# Altium schematic sheet Adder.SchDoc
size A4; SheetNumber: 1; SheetTotal: 1
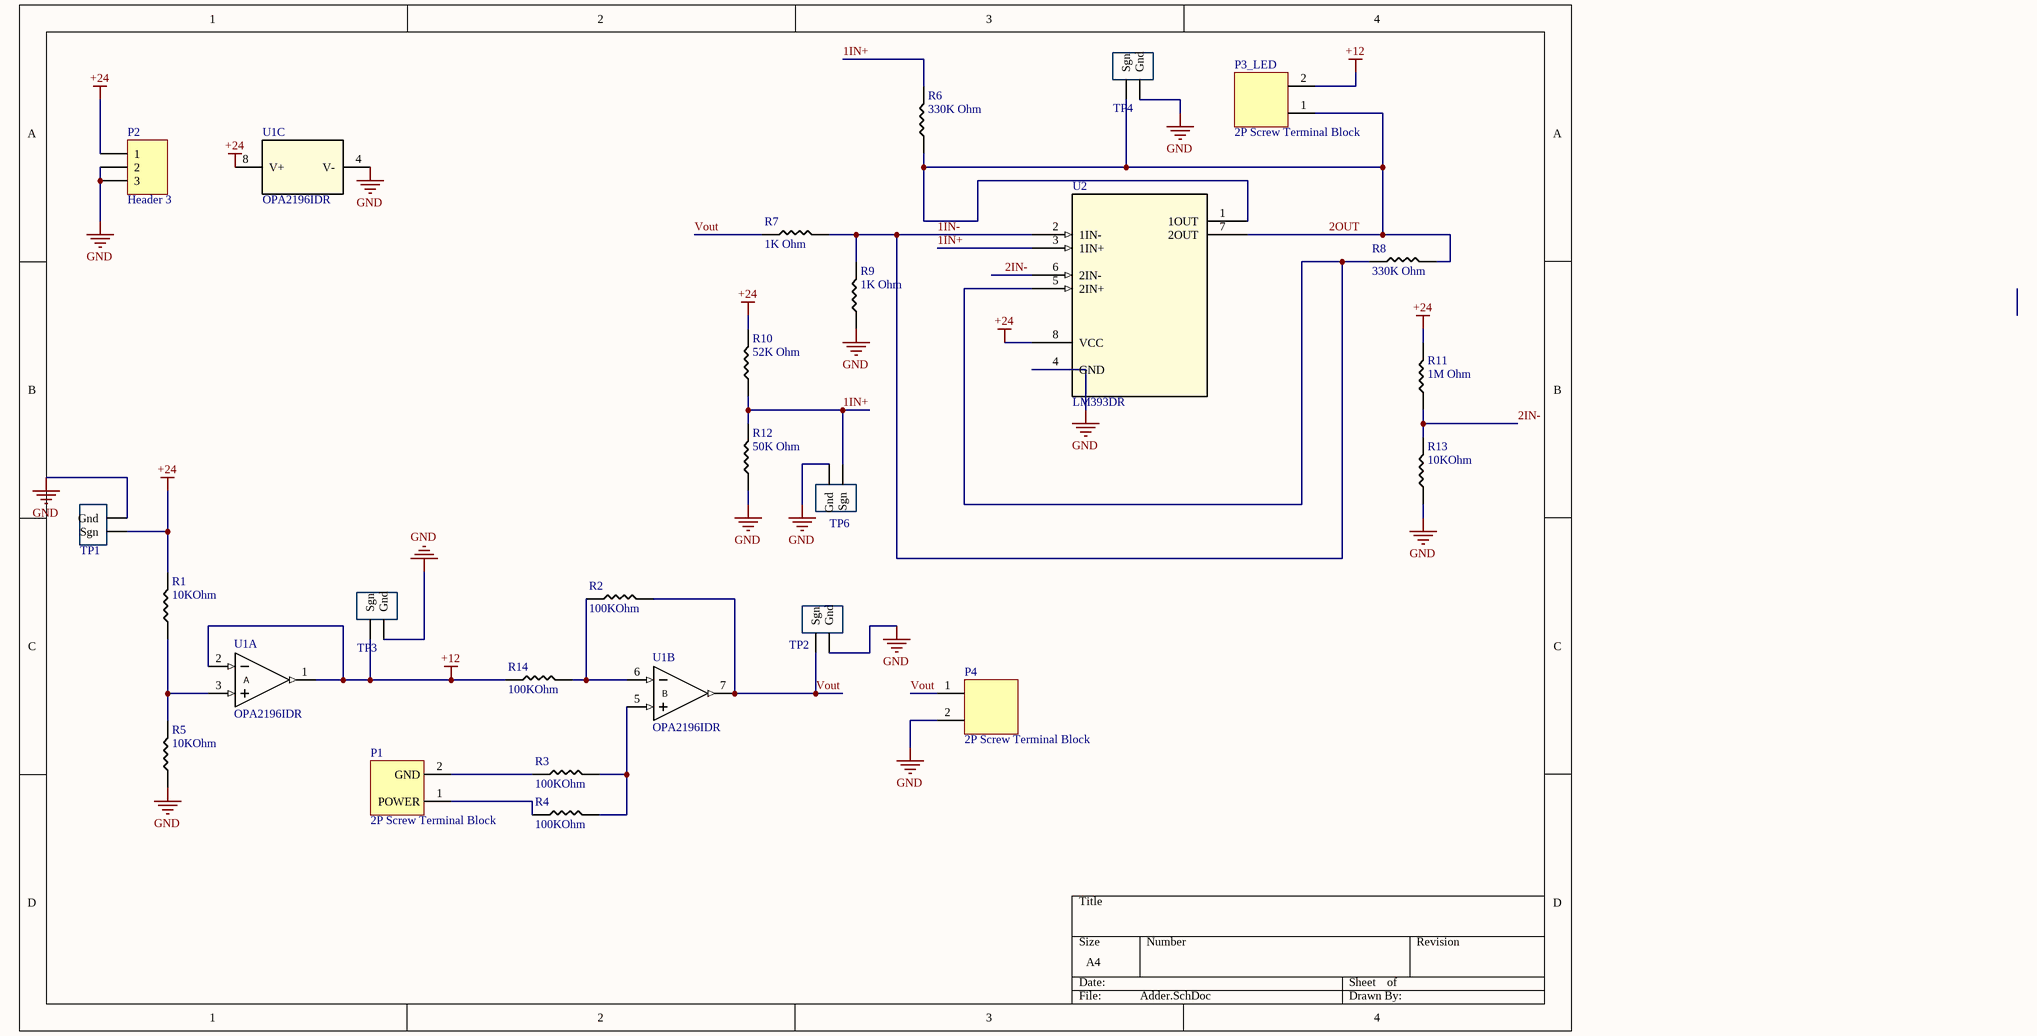
[diagram p0: Adder.SchDoc]

## Parts
P1  2P Screw Terminal Block  [P_Terminal block 3.5mm-pitch]
P2  Header 3  [HDR1X3]
P3_LED  2P Screw Terminal Block  [P_Terminal block 3.5mm-pitch]
P4  2P Screw Terminal Block  [P_Terminal block 3.5mm-pitch]
R1  value 10KOhm  [1206_Passive_Resitor]  (hidden comment: 10k)
R2  100KOhm  [1206_Passive_Resitor]
R3  100KOhm  [1206_Passive_Resitor]
R4  100KOhm  [1206_Passive_Resitor]
R5  value 10KOhm  [1206_Passive_Resitor]  (hidden comment: 10k)
R6  value 330K Ohm  [1206_Passive_Resitor]  (hidden comment: 1k)
R7  value 1K Ohm  [1206_Passive_Resitor]  (hidden comment: 1k)
R8  value 330K Ohm  [1206_Passive_Resitor]  (hidden comment: 1k)
R9  value 1K Ohm  [1206_Passive_Resitor]  (hidden comment: 1k)
R10  value 52K Ohm  [1206_Passive_Resitor]  (hidden comment: 52k)
R11  value 1M Ohm  [1206_Passive_Resitor]  (hidden comment: 1M)
R12  value 50K Ohm  [1206_Passive_Resitor]  (hidden comment: 1k)
R13  value 10KOhm  [1206_Passive_Resitor]  (hidden comment: 10k)
R14  100KOhm  [1206_Passive_Resitor]
TP1  10x Probe TP  [TP10x_Probe]  (value not drawn)
TP2  10x Probe TP  [TP10x_Probe]  (value not drawn)
TP3  10x Probe TP  [TP10x_Probe]  (value not drawn)
TP4  10x Probe TP  [TP10x_Probe]  (value not drawn)
TP6  10x Probe TP  [TP10x_Probe]  (value not drawn)
U1  OPA2196IDR  [D0008A_N]  (parts A,B,C of 3)
U2  LM393DR  [D8]

## Nets
+12: P3_LED.2(GND) R14.1 TP3.1(Sgn) U1.1(OUT) U1.2(IN-)
+24: P2.1 R1.2 R10.2 R11.2 TP1.1(Sgn) U1.8(V+) U2.8(VCC)
GND: P2.2 P2.3 P4.2(GND) R5.1 R9.1 R12.1 R13.1 TP1.2(Gnd) TP2.2(Gnd) TP3.2(Gnd) TP4.2(Gnd) TP6.2(Gnd) U1.4(V-) U2.4(GND)
1IN+: R6.2 R10.1 R12.2 TP6.1(Sgn) U2.3(1IN+)
1IN-: R7.2 R8.1 R9.2 U2.2(1IN-) U2.5(2IN+)
2IN-: R11.1 R13.2 U2.6(2IN-)
2OUT: P3_LED.1(POWER) R6.1 R8.2 TP4.1(Sgn) U2.1(1OUT) U2.7(2OUT)
Vout: P4.1(POWER) R2.2 R7.1 TP2.1(Sgn) U1.7(OUT)
NetP1_1: P1.1(POWER) R4.1
NetP1_2: P1.2(GND) R3.1
NetR1_1: R1.1 R5.2 U1.3(IN+)
NetR2_1: R2.1 R14.2 U1.6(IN-)
NetR3_2: R3.2 R4.2 U1.5(IN+)

## Notes on the sheet
- (in symbol OPA2196IDR, part A) A
- (in symbol OPA2196IDR, part B) B

## Library data of the parts
P1 P3_LED P4 = P_Terminal block: Green Straight pin 3.5mm  pitch; P=3.5mm  Screw terminal ROHS; MFR Part #: KF350-3.5-2P; Manufacturer: Cixi Kefa Elec; LCSC Part#: C474892; DataSheet: https://datasheet.lcsc.com/lcsc/2001160007_Cixi-Kefa-Elec-KF350-3-5-2P_C474892.pdf
P2 = Header 3: Header, 3-Pin; LatestRevisionDate: 17-Jul-2002; LatestRevisionNote: Re-released for DXP Platform.; Publisher: Altium Limited
R1 R5 R13 = R_10KOhm_1206: 10 kOhms ±5% 0.25W, 1/4W Chip Resistor 1206 (3216 Metric) Automotive AEC-Q200 Thick Film; MFR Part #: RMCF1206FT10K0; Digikey Link: https://www.digikey.com/en/products/detail/stackpole-electronics-inc/RMCF1206FT10K0/1759669; LCSC Part#: C17902; Type: Basic
R2-R4 R14 = R_100KOhm_1206: 100kΩ ±1% 0.25W ±100ppm/℃ 1206 Chip Resistor - Surface Mount RoHS; MFR Part #: 1206W4F1003T5E; LCSC Part#: C17900; Datasheet: https://datasheet.lcsc.com/lcsc/1810301421_UNI-ROYAL-Uniroyal-Elec-1206W4F1003T5E_C17900.pdf; Type: Basic; Value: 100KOhm
R6-R9 R12 = R_1K_1206: CHIP RESISTOR - SURFACE MOUNT 1KOHMS ±1% 1/4W 1206 ROHS; MFR Part #: RNCP1206FTD1K00CT; Digikey Link: https://www.digikey.com/product-detail/en/RNCP1206FTD1K00/RNCP1206FTD1K00CT-ND/2240675/?itemSeq=304982373; LCSC Part#: C4410; Type: Basic
R10 = R_1K_1206: CHIP RESISTOR - SURFACE MOUNT 52KOHMS ±1% 1/4W 1206 ROHS; MFR Part #: RNCP1206FTD1K00CT; Digikey Link: https://www.digikey.com/product-detail/en/RNCP1206FTD1K00/RNCP1206FTD1K00CT-ND/2240675/?itemSeq=304982373; LCSC Part#: C4410; Type: Basic
R11 = R_1M_1206: CHIP RESISTOR - SURFACE MOUNT 1MOHMS ±1% 1/4W 1206 ROHS; MFR Part #: RMCF1206JT1M00; Digikey Link: https://www.digikey.com/product-detail/en/RMCF1206JT1M00/RMCF1206JT1M00CT-ND/1942830/?itemSeq=304982358; LCSC Part#: C17927; Type: Basic
TP1-TP4 TP6 = TP_10x_Probe: Test Point 300 mil centers
U1 = OPA2196IDR: Dual, 36-V, low power, all-purpose amplifier with mux-friendly input 8-SOIC -40 to 125; Manufacturer_Name: Texas Instruments; TYPE: TYPE; RefDes: RefDes; Copyright: Copyright (C) 2026 Ultra Librarian. All rights reserved.; Manufacturer_Part_Number: OPA2196IDR; Datasheet: https://www.ti.com/lit/gpn/opa2196
U2 = LM393DR: Dual differential comparator, commercial grade 8-SOIC 0 to 70; Manufacturer_Name: Texas Instruments; Copyright: Copyright (C) 2025 Ultra Librarian. All rights reserved.; Manufacturer_Part_Number: LM393DR; RefDes: RefDes; Type: Type